# EAGLE design VCO (EAGLE 9.6.2)
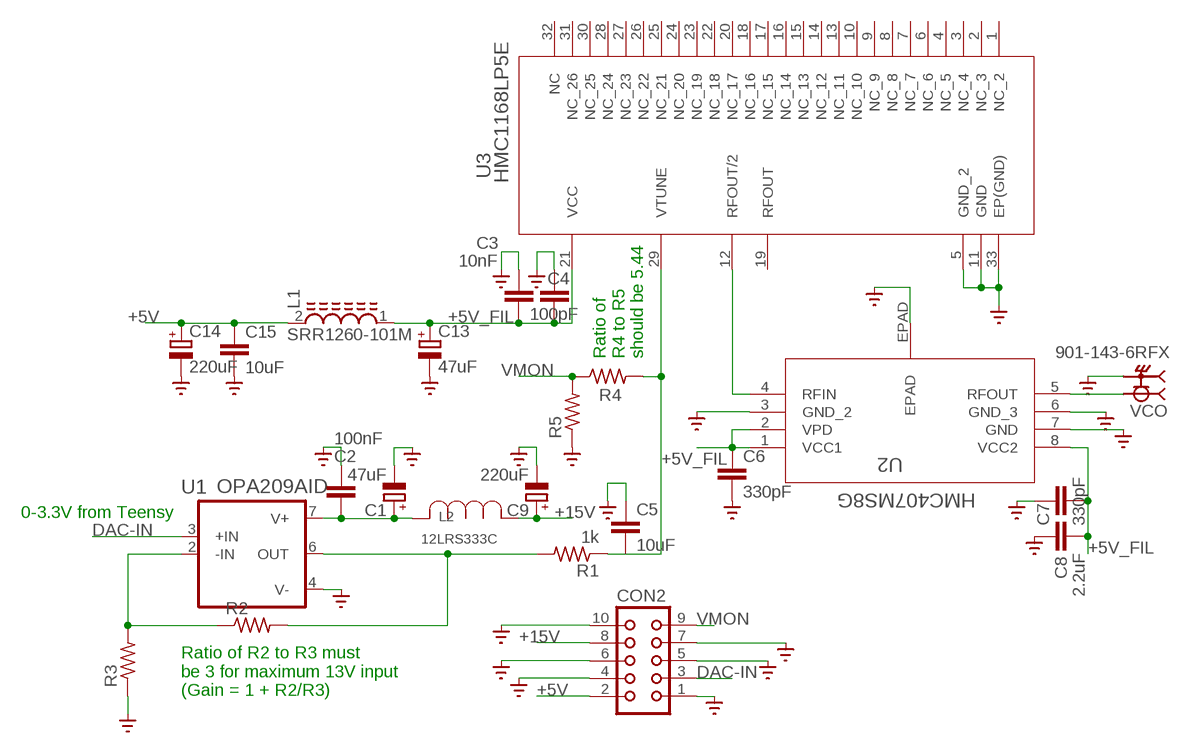
[diagram p0: schematic, sheet 1]

## Parts
C1  47uF  CPOL-EU175TMP-0808  [175TMP-0808]
C2  100nF  C-EUC1206  [C1206]
C3  10nF  C-EUC0603  [C0603]
C4  100pF  C-EUC0603  [C0603]
C5  10uF  C-EUC1206  [C1206]
C6  330pF  C-EUC0603  [C0603]
C7  330pF  C-EUC0603  [C0603]
C8  2.2uF  C-EUC0603  [C0603]
C9  220uF  CPOL-EUE3.5-8  [E3,5-8]
C13  47uF  CPOL-EU175TMP-0808  [175TMP-0808]
C14  220uF  CPOL-EUE3.5-8  [E3,5-8]
C15  10uF  C-EUC1206  [C1206]
CON2  CON10  [CON10]
L1  SRR1260-101M  [INDP125125X600N]
L2  12LRS333C  [IND_MURATA_1200LRS_MUR]
R1  1k  R-US_R1206  [R1206]
R2  R-US_R1206  [R1206]
R3  R-US_R1206  [R1206]
R4  R-US_R0603  [R0603]
R5  R-US_R0603  [R0603]
U1  OPA209AID  [SOIC127P599X175-8N]
U2  HMC407MS8G  [RH-8-1_ADI]
U3  HMC1168LP5E  [HCP_32_1_ADI]
VCO  901-143-6RFX  [AMPHENOL_901-143-6RFX]

## Nets
+5V: C14.+ C15.1 CON2.2 L1.2
+5V_FIL: C3.2 C4.2 C6.1 C7.2 C8.2 C13.+ L1.1 U2.1(VCC1) U2.2(VPD) U2.8(VCC2) U3.21(VCC)
+15V: C9.+ CON2.8 L2.1
DAC-IN: CON2.3 U1.3(+IN)
GND: C1.- C2.1 C3.1 C4.1 C5.1 C6.2 C7.1 C8.1 C9.- C13.- C14.- C15.2 CON2.1 CON2.4 CON2.5 CON2.6 CON2.7 CON2.10 R3.1 R5.1 U1.4(V-) U2.3(GND_2) U2.6(GND_3) U2.7(GND) U2.EPAD U3.5(GND_2) U3.11(GND) U3.33(EP(GND)) VCO.S1 VCO.S2 VCO.S3 VCO.S4 ; supply symbol labelled SUPPLY0_GND_
N$1: U2.4(RFIN) U3.12(RFOUT/2)
N$2: U2.5(RFOUT) VCO.1
N$4: C5.2 R1.1 R4.2 U3.29(VTUNE)
N$5: R2.1 R3.2 U1.2(-IN)
N$6: C1.+ C2.2 L2.3 U1.7(V+)
N$7: R1.2 R2.2 U1.6(OUT)
VMON: CON2.9 R4.1 R5.2
Unconnected: U3.1(NC_2) U3.2(NC_3) U3.3(NC_4) U3.4(NC_5) U3.6(NC_6) U3.7(NC_7) U3.8(NC_8) U3.9(NC_9) U3.10(NC_10) U3.13(NC_11) U3.14(NC_12) U3.15(NC_13) U3.16(NC_14) U3.17(NC_15) U3.18(NC_16) U3.19(RFOUT) U3.20(NC_17) U3.22(NC_18) U3.23(NC_19) U3.24(NC_20) U3.25(NC_21) U3.26(NC_22) U3.27(NC_23) U3.28(NC_24) U3.30(NC_25) U3.31(NC_26) U3.32(NC)

## Notes on the sheet
- Ratio of 
  R4 to R5
  should be 5.44
- 0-3.3V from Teensy
- Ratio of R2 to R3 must
  be 3 for maximum 13V input
  (Gain = 1 + R2/R3)

## Library data of the parts
C1 C9 C13 C14 = rcl:CPOL-EU: POLARIZED CAPACITOR, European symbol; SPICEPREFIX: C
C2-C8 C15 = rcl:C-EU: CAPACITOR, European symbol; SPICEPREFIX: C
CON2 = con-harting:CON10: CONNECTOR; OC_FARNELL: unknown; OC_NEWARK: unknown
L1 = SRR1260-101M:SRR1260-101M: Inductor Power Shielded Wirewound 33uH 20% 100KHz 27Q-Factor Ferrite 3A 60mOhm DCR T/R Check prices <https://pricing.snapeda.com/parts/SRR1260-101M/Bourns/view-part?ref=eda>; AVAILABILITY: Good; DESCRIPTION: 100µH Shielded Wirewound Inductor 1.7A 180mOhm Max Nonstandard; MF: Bourns; MP: SRR1260-101M; PACKAGE: Nonstandard Bourns; PRICE: None; PURCHASE-URL: https://pricing.snapeda.com/search/part/SRR1260-101M/?ref=eda
L2 = 12LRS333C:12LRS333C: MURATA 33uH 2.1A INDUCTOR; BUILT_BY: EMA_UL_Team; MANUFACTURER_PART_NUMBER: 12LRS333C; SOURCELIBRARY: Murata_2010-01-01IND_1200LRS; VENDOR: Murata
R1-R5 = rcl:R-US_: RESISTOR, American symbol; SPICEPREFIX: R
U1 = OPA209AID:OPA209AID; AVAILABILITY: Unavailable; DESCRIPTION: Single, 2.2nV/rtHz, 18MHz, Precision, RRO, 36V Operational Amplifier 8-SOIC -40 to 125; MF: Texas Instruments; MP: OPA209AID; PACKAGE: SOIC-8 Texas Instruments; PRICE: None; PURCHASE-URL: https://pricing.snapeda.com/search/part/OPA209AID/?ref=eda
U2 = HMC407MS8G:HMC407MS8G: ANALOG DEVICES HMC407 RF POWER AMP 5GHZ-7GHZ; BUILT_BY: SunStream; COPYRIGHT: Copyright (C) 2018 Accelerated Designs. All rights reserved; MANUFACTURER_PART_NUMBER: HMC407MS8G; SOURCELIBRARY: Analog_Devices_Inc_2020-09-15; VENDOR: Analog Devices Inc
U3 = HMC1168LP5E:HMC1168LP5E: HMC1168LP5E VCO 6.5475GHz 13.095 GHz; BUILT_BY: Analog Devices Imc.; MANUFACTURER_PART_NUMBER: HMC1168LP5E; SOURCELIBRARY: Analog_2018-01-18; VENDOR: Analog Devices Inc
VCO = 901-143-6RFX:901-143-6RFX: connector, rf coaxial, sma rt angle pcb jack recept, 4 legs, blunt post term, gold Check prices <https://pricing.snapeda.com/parts/901-143-6RFX/Amphenol%20RF/view-part?ref=eda>; AVAILABILITY: In Stock; DESCRIPTION: SMA Connector Jack, Female Socket 50Ohm Through Hole, Right Angle Solder; MF: Amphenol RF; MP: 901-143-6RFX; PACKAGE: None; PRICE: None

## Net classes
0 default: width 0.14 mm

## Board
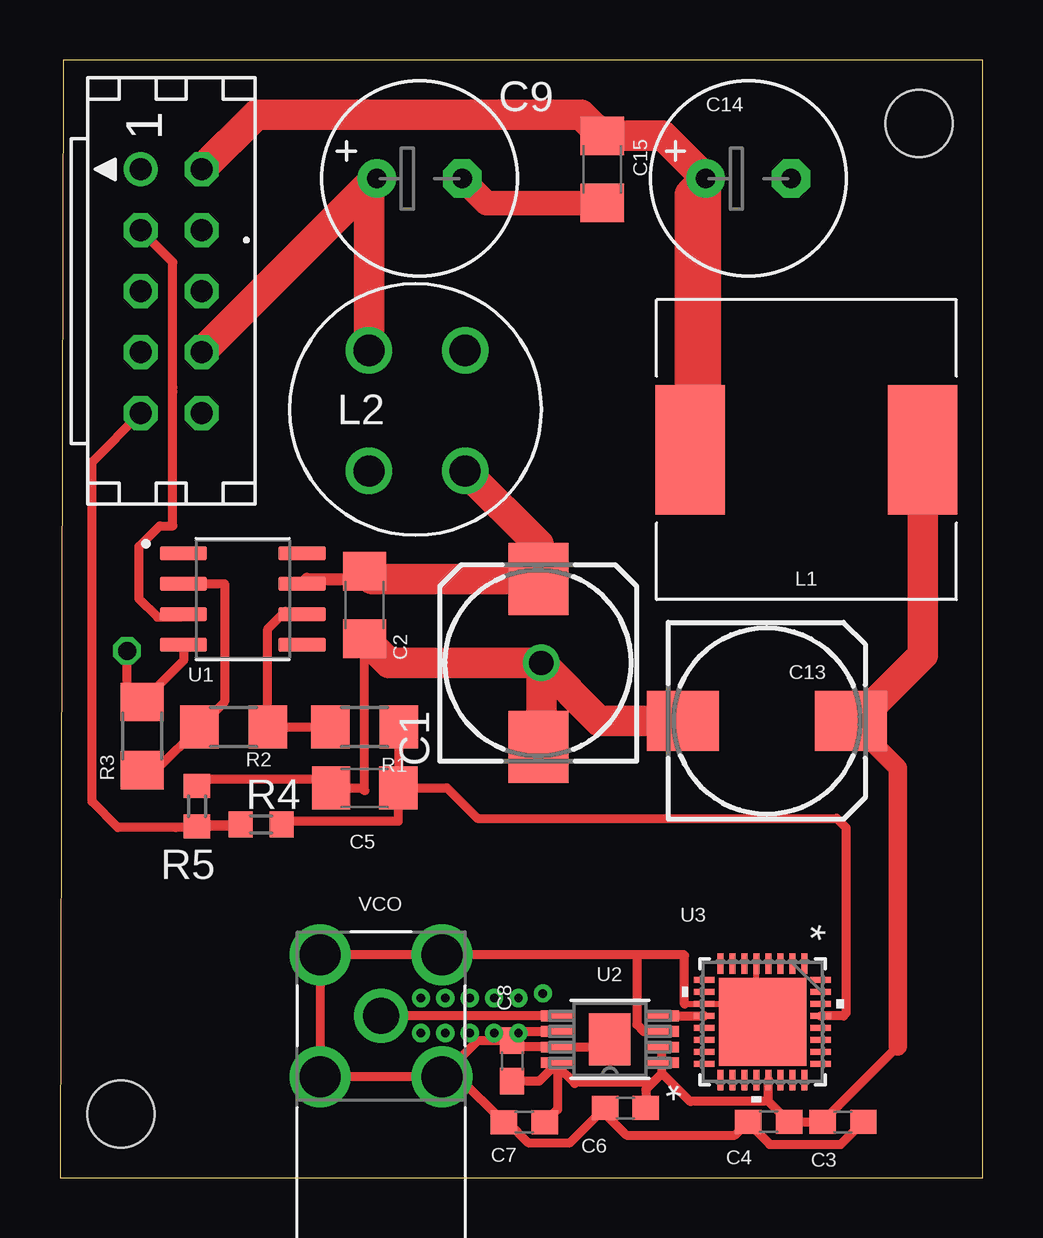
[diagram p1: board, top side]
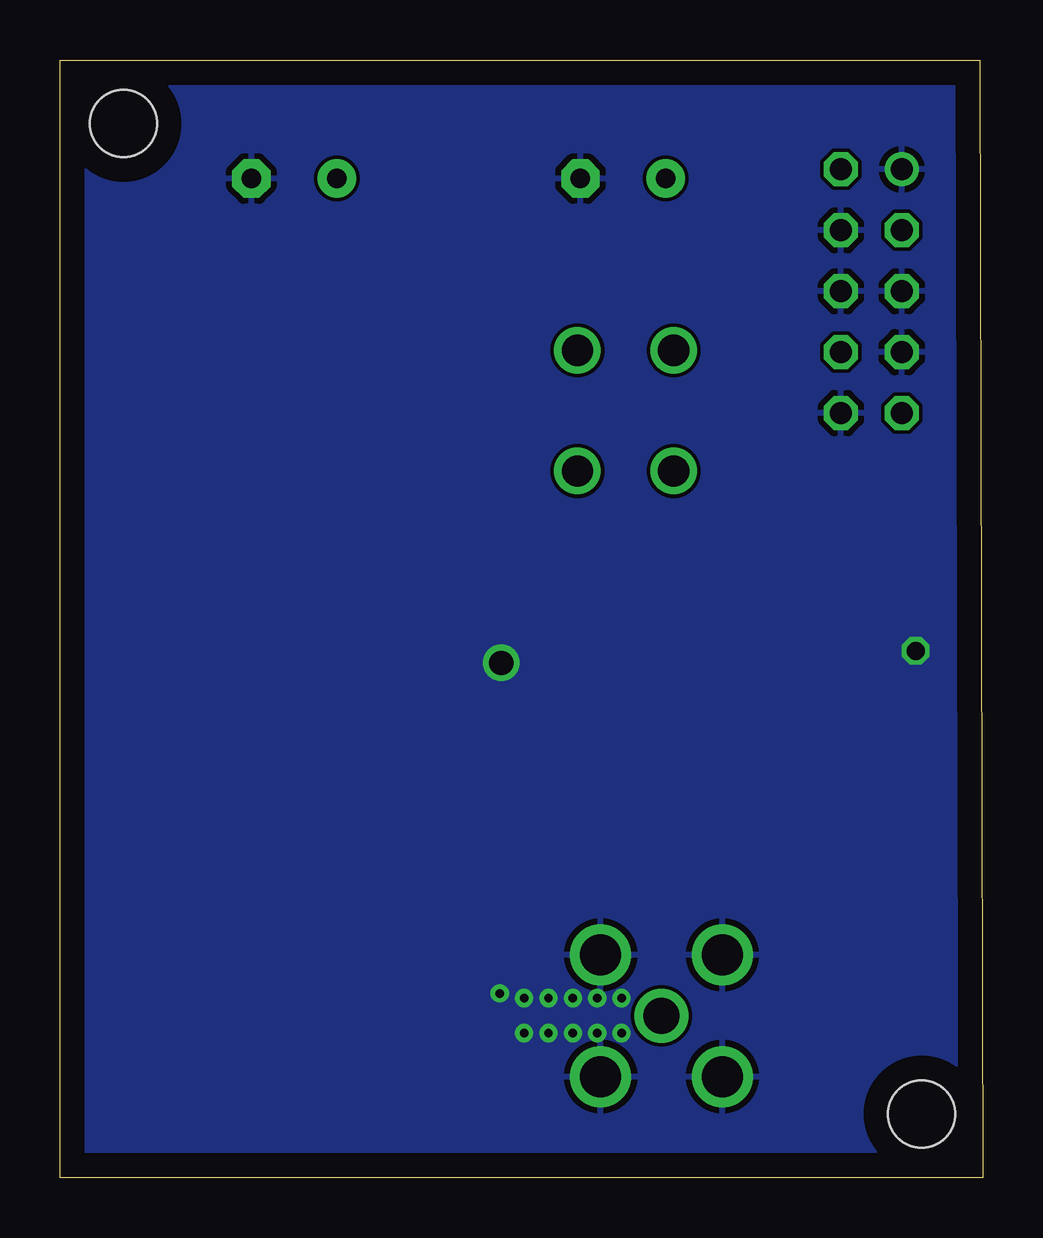
[diagram p2: board, bottom side, seen from below]

Size 38.46 x 46.6 mm. Coordinates in mm from the lower left corner, seen from the top.
Outline: 0,0 38.46,0 38.46,46.6 0.13,46.6 0,0
Copper layers (1*16): Top 0.035mm / dielectric 1.5mm / Bottom 0.035mm
Design rules "default": minimum track width 6mil, minimum drill 0.35mm, track to track 6mil, track to pad 6mil, pad to pad 6mil, via to via 6mil, smd to smd 6mil, copper to edge 40mil, drill to drill 6mil, minimum pad ring 10mil, minimum via ring 8mil, stop-mask expansion 4mil, vias tented up to drill 0mil, thermal gap 10mil
Holes 2.79 mm at 35.81,43.94 2.54,2.67

### Footprints (pad centres in the part's own frame; a part is rotated, then mirrored left to right if it is on the bottom)
175TMP-0808 = smd 3 x 2.5: + 3.5,0; - -3.5,0
C1206 = smd 1.6 x 1.8: 1 -1.4,0; 2 1.4,0
C0603 = smd 1.1 x 1: 1 -0.85,0; 2 0.85,0
E3,5-8 = drill 0.813 pad 1.6: + -1.778,0 | drill 0.813 pad 1.6 octagon: - 1.778,0
CON10 = drill 0.914: 1 -5.08,-1.27 | drill 0.914 octagon: 2 -5.08,1.27; 3 -2.54,-1.27; 4 -2.54,1.27; 5 0,-1.27; 6 0,1.27; 7 2.54,-1.27; 8 2.54,1.27; 9 5.08,-1.27; 10 5.08,1.27
INDP125125X600N = smd 2.9 x 5.4: 1 -4.85,0; 2 4.85,0
IND_MURATA_1200LRS_MUR = drill 1.295 pad 1.803: 1 -4.775,5.283; 2 -4.775,0.254; 3 -0.762,0.254; 4 -0.762,5.283
R1206 = smd 1.6 x 1.803: 1 -1.422,0; 2 1.422,0
R0603 = smd 1 x 1.1: 1 -0.85,0; 2 0.85,0
SOIC127P599X175-8N = smd 1.97 x 0.6: 1 -2.47,1.905; 2 -2.47,0.635; 3 -2.47,-0.635; 4 -2.47,-1.905; 5 2.47,-1.905; 6 2.47,-0.635; 7 2.47,0.635; 8 2.47,1.905
RH-8-1_ADI = smd 1.411 x 0.451: 1 -2.175,0.975; 2 -2.175,0.325; 3 -2.175,-0.325; 4 -2.175,-0.975; 5 2.175,-0.975; 6 2.175,-0.325; 7 2.175,0.325; 8 2.175,0.975 | smd 1.73 x 2.16: EPAD 0,0
HCP_32_1_ADI = smd 0.855 x 0.249: 1 -2.427,1.75; 2 -2.427,1.25; 3 -2.427,0.75; 4 -2.427,0.25; 5 -2.427,-0.25; 6 -2.427,-0.75; 7 -2.427,-1.25; 8 -2.427,-1.75; 17 2.427,-1.75; 18 2.427,-1.25; 19 2.427,-0.75; 20 2.427,-0.25; 21 2.427,0.25; 22 2.427,0.75; 23 2.427,1.25; 24 2.427,1.75 | smd 0.249 x 0.855: 9 -1.75,-2.427; 10 -1.25,-2.427; 11 -0.75,-2.427; 12 -0.25,-2.427; 13 0.25,-2.427; 14 0.75,-2.427; 15 1.25,-2.427; 16 1.75,-2.427; 25 1.75,2.427; 26 1.25,2.427; 27 0.75,2.427; 28 0.25,2.427; 29 -0.25,2.427; 30 -0.75,2.427; 31 -1.25,2.427; 32 -1.75,2.427 | smd 3.65 x 3.65: 33 0,0
AMPHENOL_901-143-6RFX = drill 1.5 pad 2.25: 1 0,0 | drill 1.7 pad 2.55: S1 -2.54,2.54; S2 2.54,2.54; S3 -2.54,-2.54; S4 2.54,-2.54

### Placement (x,y rotation side)
C1  19.94,21.46 90 top
C2  12.7,23.88 90 top
C3  32.64,2.34 180 top
C4  29.54,2.34 0 top
C5  12.7,16.26 0 top
C6  23.57,2.92 180 top
C7  19.35,2.31 0 top
C8  18.85,4.88 270 top
C9  14.99,41.66 0 top
C13  29.46,19.05 0 top
C14  28.7,41.66 0 top
C15  22.61,42.04 270 top
CON2  4.64,36.96 270 top
L1  31.11,30.35 180 top
L2  17.65,29.21 0 top
R1  12.7,18.8 180 top
R2  7.24,18.8 0 top
R3  3.43,18.41 270 top
R4  8.38,14.73 0 top
R5  5.71,15.49 270 top
U1  7.62,24.13 0 top
U2  22.92,5.78 180 top
U3  29.29,6.5 270 top
VCO  13.39,6.76 0 top

### Tracks (layer width: path | path; a pad name or v marks a point on that pad's centre or on a via)
+5V
  Top 1.27: CON2.2 8.19,44.32 21.72,44.32 C15.1 25.14,43.44 C14.+ | C14.+ 26.92,30.48 26.29,29.84 | L1.2 26.27,41 C14.+
+5V_FIL
  Top 0.381: 34.92,5.47 C3.2 C4.2 29.54,3.19 | 29.54,3.19 U3.21 | 29.54,3.19 26.3,3.19 26.29,3.17 25.1,4.37 | 25.1,4.37 U2.1 U2.2 | 25.1,4.37 24.72,3.98 | 24.72,3.98 24.42,3.69 C6.1 | 24.72,3.98 21.51,3.98 21.46,3.94 20.75,4.65 U2.8 | U2.8 19.97,4.03 C8.2 | U2.8 20.75,2.85 C7.2
  Top 0.508: L1.1 35.97,22.05 C13.+ 32.96,18.8
  Top 0.762: C13.+ 34.92,17.09 34.92,5.47
  Top 1.27: L1.1 35.97,21.8 32.96,18.8
+15V
  Top 1.27: CON2.8 9.75,38.26 13.14,41.66 C9.+ 12.88,41.33 12.88,35.13 L2.1
DAC-IN
  Top 0.381: U1.3 5.02,23.37 4.06,23.37 3.3,24.13 3.3,26.32 4.16,27.18 4.7,27.18 4.7,32.77 4.7,32.96 4.7,38.16 CON2.3
GND  (via drill 0.35, 0.75 pad 0.6, 1.02)
  Top 0.203: 24.26,9.3 24.13,9.3 24.04,9.21 | C8.1 19.16,5.73 | 20.63,5.33 U2.7 | 24.38,6.1 U2.3
  Top 0.254: U3.5 29.04,6.75 U3.33 28.54,7.25 U3.11 26.84,7.24 26.04,7.24
  Top 0.381: U1.4 5.15,21.56 R3.1 3.4,19.81 3.3,19.81 2.79,20.32 v2.79,21.97 | VCO.S4 VCO.S3 VCO.S1 VCO.S2 24.13,9.3 26.01,9.3 26.04,9.27 26.04,7.24 | C2.1 12.7,16.13 12.57,16.26 C5.1 10.92,16.64 6.01,16.64 R5.1 | VCO.S4 16.6,4.22 C7.1 18.67,2.31 19.51,1.47 21.27,1.47 C6.2 22.72,2.68 23.62,1.78 28.13,1.78 C4.1 28.69,2.3 29.59,1.4 32.55,1.4 C3.1 | VCO.S4 17.44,5.73 C8.1 | U2.EPAD 22.8,5.78 22.47,5.45 U2.7 19.12,5.45 C8.1 | 24.38,6.1 24.33,6.1 24.04,6.39 24.04,9.21 | C8.1 19.22,6.1 U2.6
  Top 1.016: C15.2 17.78,40.64 C9.-
  Top 1.27: C2.1 13.71,21.46 v20.07,21.46 | v20.07,21.46 20.07,18.09 C1.- | C13.- 22.48,19.05 v20.07,21.46
  other vias: 19.11,6.03 18.1,6.03 17.08,6.03 16.07,6.03 15.05,6.03 15.05,7.49 16.07,7.49 17.08,7.49 18.1,7.49 19.11,7.49 20.13,7.68
  pour Bottom: 0,46.23 38.35,46.23 38.35,0.13 0,0.13
N$1
  Top 0.381: U2.4 U3.12
N$2
  Top 0.381: U2.5 VCO.1
N$4
  Top 0.381: R1.1 14.12,16.28 C5.2 | C5.2 16.13,16.26 17.4,14.99 32.38,14.99 32.77,14.61 32.77,6.86 32.66,6.75 U3.29 | R4.2 9.36,14.86 14.1,14.86 C5.2
N$5
  Top 0.381: U1.2 6.86,24.77 6.86,19.84 R2.1 4.01,16.99 R3.2
N$6
  Top 0.508: U1.7 10.29,24.96 13.01,24.96
  Top 1.27: L2.3 19.94,26.42 C1.+ 13.01,24.96 C2.2
N$7
  Top 0.381: 9.27,23.5 9.4,23.62 | R1.2 R2.2 8.66,22.88 9.27,23.5 | 9.27,23.5 U1.6
VMON
  Top 0.381: CON2.9 1.33,29.84 1.33,15.68 2.41,14.61 4.83,14.61 5.68,14.61 R5.2 | 7.06,14.64 R5.2 | R5.2 5.8,14.73 R4.1